# EasyEDA Pro project ProDoc_HEMY Brake Driver 1.1_2025-03-20.epro

# Schematic HEMY Brake Driver 1.1
Board Name: HEMY Brake Driver 1.1; Create Date: 2024-11-18; Page Name: Board; Project Name: TeenAstro Redux B; Schematic Name: HEMY Brake Driver 1.1; Update Date: 2024-12-15; Company: Club Astro Vélizy; Drawn: P. VINCENT; Page Size: A5; Part Number: HEMY_BRAKE_001; Reviewed: P. VINCENT; Version: V1.0
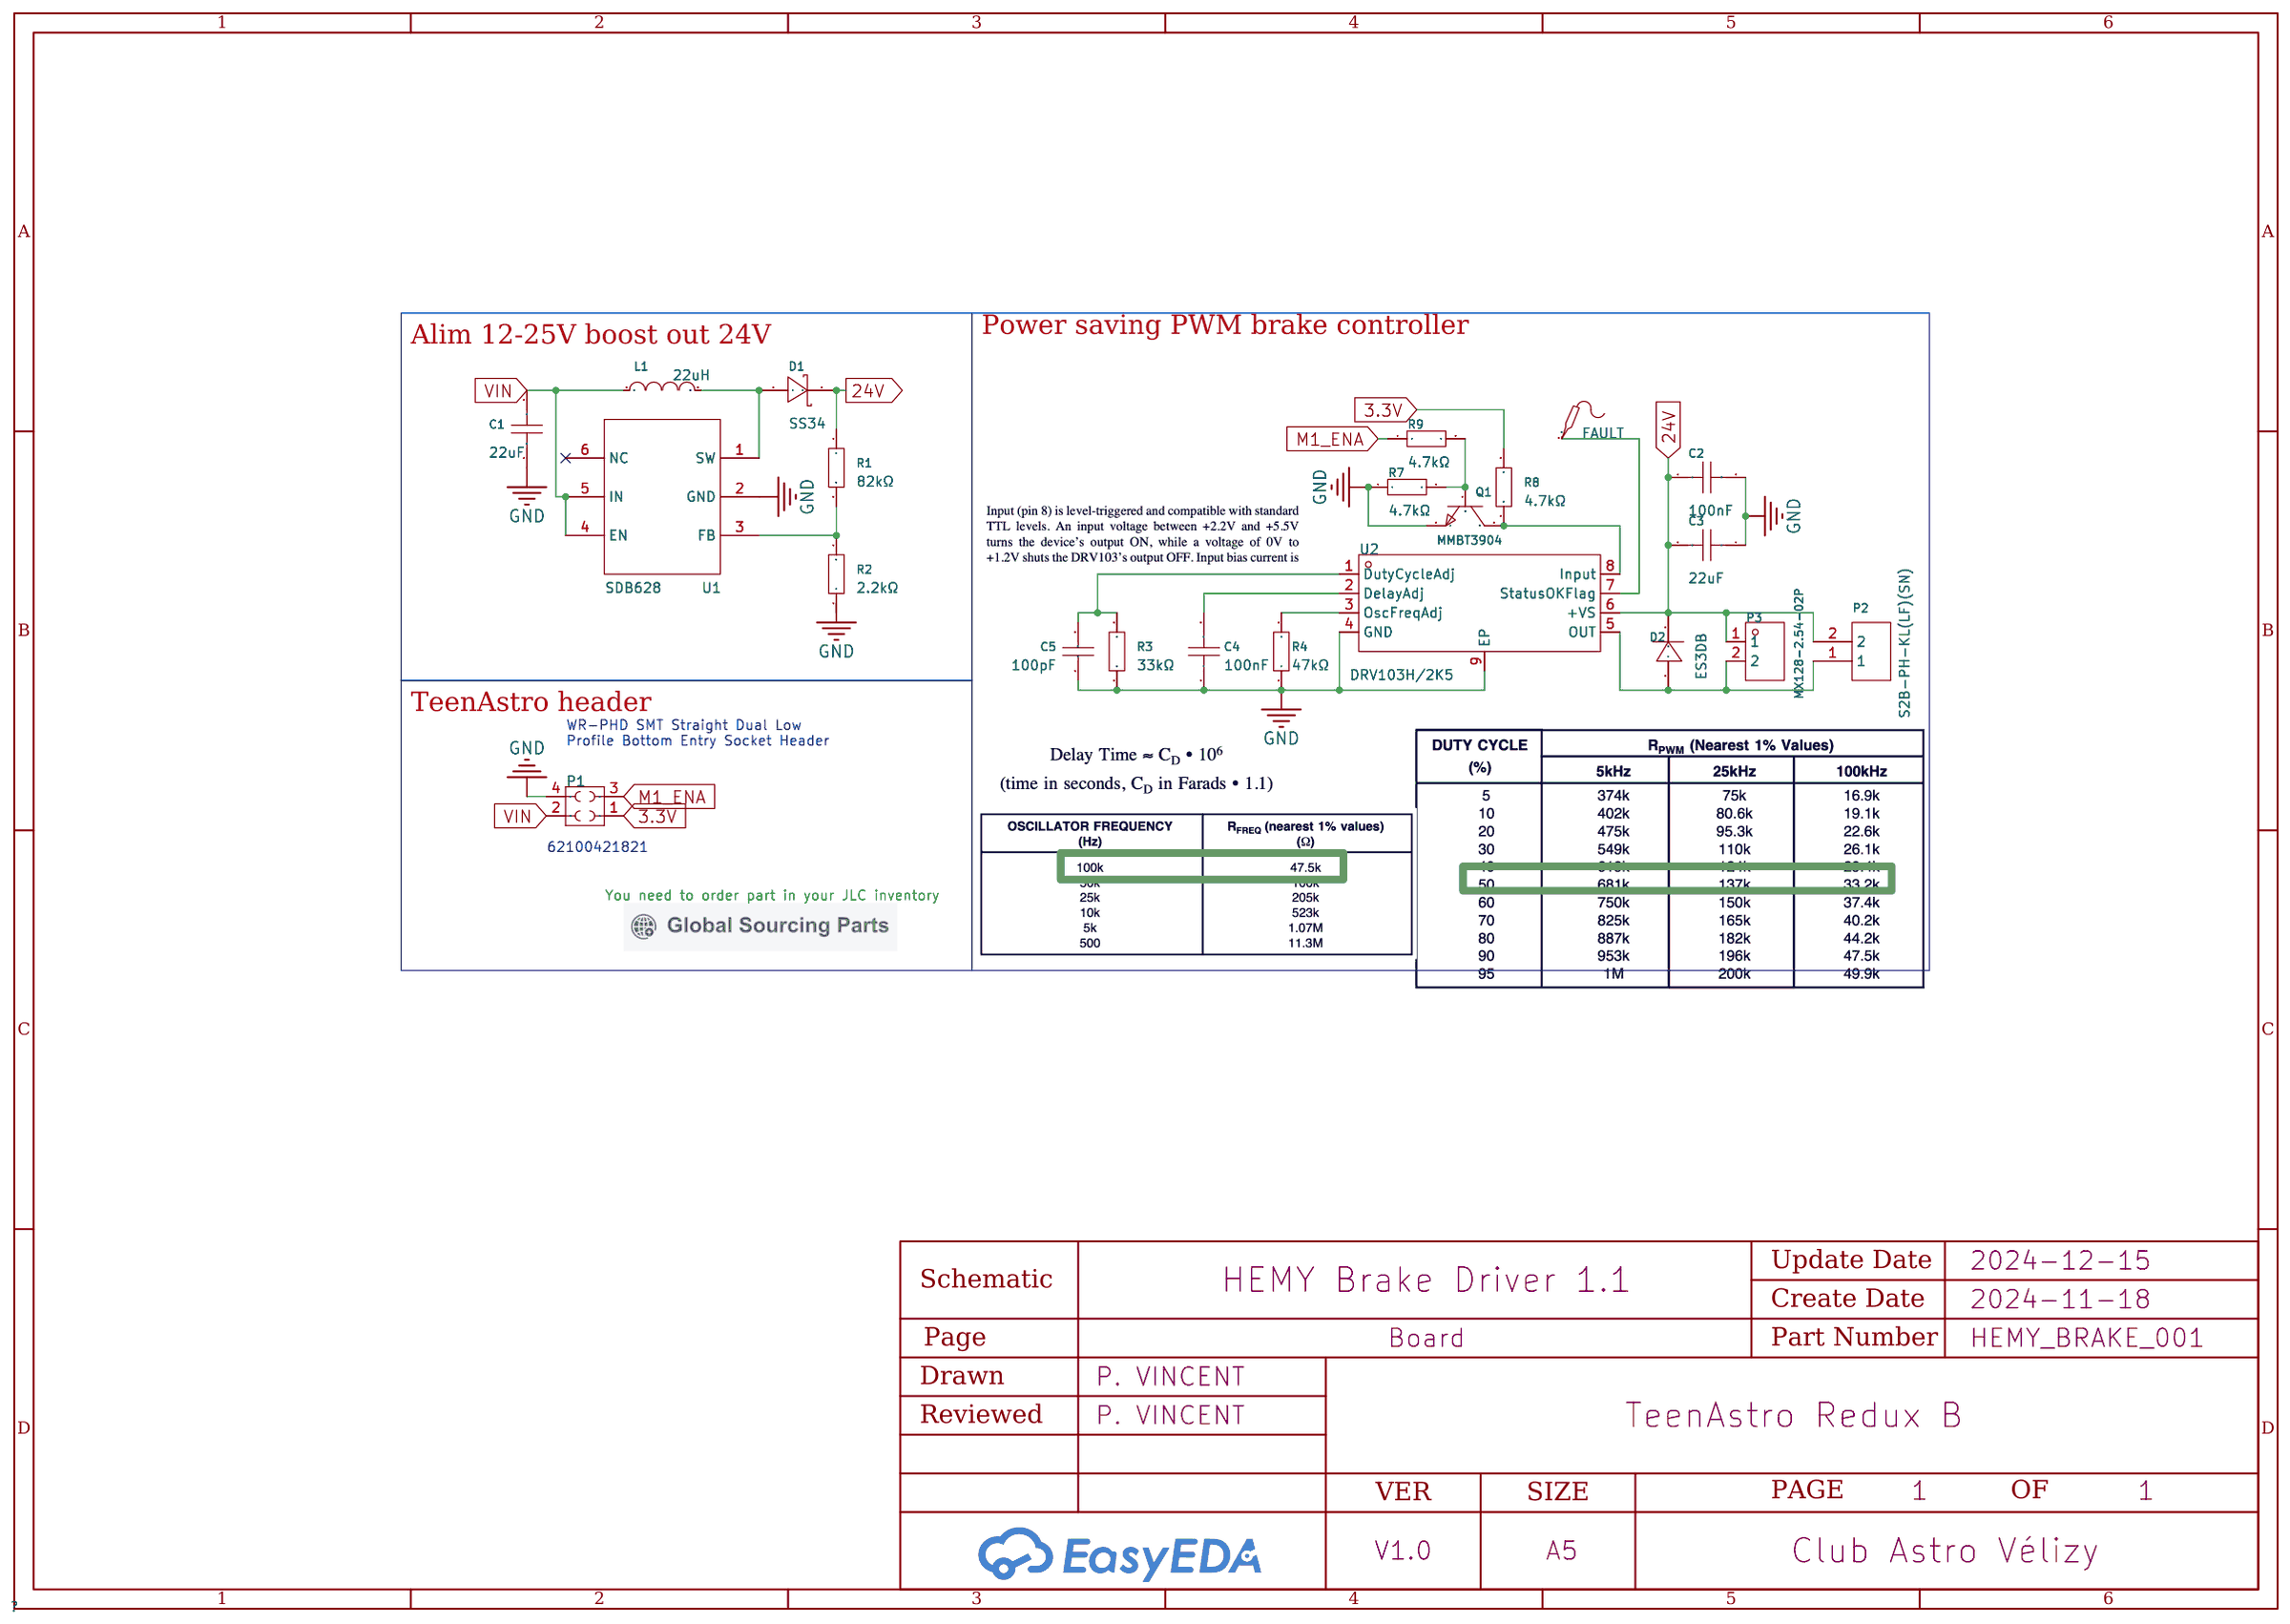
[diagram p0: schematic sheet]

## Parts
C1  22uF  [C0805]
C2  100nF  [C0805]
C3  22uF  [C0805]
C4  100nF  [C0603]
C5  100pF  [C0603]
D1  SS34  [SMA_L4.3-W2.6-LS5.2-RD]
D2  ES3DB  [SMB_L4.6-W3.6-LS5.3-RD]
FAULT  -  [Test-Point-0.5mm]
L1  22uH  [IND-SMD_L7.1-W6.6]
P1  -  [62100421821]
P2  S2B-PH-KL(LF)(SN)  [CONN-TH-2P-P2.00_S2B-PH-KL-LF-SN]  (no BOM)
P3  MX128-2.54-02P  [CONN-TH_2P-P2.54_MX128-2.54-GN01-02P-CU-Y-A]
Q1  MMBT3904  [SOT-23-3_L2.9-W1.3-P1.90-LS2.4-BR]
R1  82kΩ  [R0603]
R2  2.2kΩ  [R0603]
R3  33kΩ  [R0603]
R4  47kΩ  [R0603]
R7  4.7kΩ  [R0603]
R8  4.7kΩ  [R0603]
R9  4.7kΩ  [R0603]
U1  SDB628  [SOT-23-6_L2.9-W1.6-P0.95-LS2.8-BR]
U2  DRV103H/2K5  [SOIC-8_L4.9-W3.9-P1.27-LS6.0-BL-EP2.3]

## Library data of the parts
C1 C3 = CGA0805X5R226M350MT: Capacitance:22uF Tolerance:±20% Tolerance:±20% Voltage Rated: Temperature Coefficient:; LCSC Part Name: 22uF ±20% 35V; Supplier Part: C6119901; Manufacturer: HRE(芯声); Supplier Footprint: 0805; JLCPCB Part Class: Extended Part; Datasheet: https://atta.szlcsc.com/upload/public/pdf/source/20231129/D589D0CC4D260F7AC3A77E53B455CCB3.pdf; Supplier: LCSC; Tolerance: ±20%
C2 = CC0805KRX7R9BB104: Capacitance: Tolerance:±10% Tolerance:±10% Voltage Rated: Temperature Coefficient:; LCSC Part Name: 100nF ±10% 50V; Supplier Part: C49678; Manufacturer: YAGEO(国巨); Supplier Footprint: 0805; JLCPCB Part Class: Basic Part; Datasheet: https://atta.szlcsc.com/upload/public/pdf/source/20180224/C181747_15194369449651363981.pdf; Supplier: LCSC; Tolerance: ±10%
C4 = CC0603KRX7R9BB104: Capacitance: Tolerance:±10% Tolerance:±10% Voltage Rated: Temperature Coefficient:; LCSC Part Name: 100nF±10%50V; Supplier Part: C14663; Manufacturer: YAGEO(国巨); Supplier Footprint: 0603; JLCPCB Part Class: BasicPart; Datasheet: https://atta.szlcsc.com/upload/public/pdf/source/20180910/C282072_33301C7F631E79921B82A8DAC6BCC5B3.pdf; Supplier: LCSC; Tolerance: ±10%
C5 = CL10C101JB8NNNC: Capacitance: Tolerance:±5% Tolerance:±5% Voltage Rated: Temperature Coefficient:; LCSC Part Name: 100pF ±5% 50V; Supplier Part: C14858; Manufacturer: SAMSUNG(三星); Supplier Footprint: 0603; JLCPCB Part Class: Basic Part; Datasheet: https://atta.szlcsc.com/upload/public/pdf/source/20160103/1457707672333.pdf; Supplier: LCSC; Tolerance: ±5%
D1 = SS34_C8678: Diode Configuration:Single Forward Voltage (Vf@If):550mV@3A Reverse Voltage (Vr):40V Rectified Current:3A Reverse Leakage Current (Ir):500uA@40V; LCSC Part Name: 电压:40V 电流:3A; Supplier Part: C8678; Manufacturer: MDD(辰达半导体); Supplier Footprint: SMA(DO-214AC); JLCPCB Part Class: Basic Part; Datasheet: https://atta.szlcsc.com/upload/public/pdf/source/20230314/A80AE34493C69B89E2F4B1712F433538.pdf; Supplier: LCSC; Diode Configuration: Single; Forward Voltage (Vf@If): 550mV@3A; Reverse Voltage (Vr): 40V; Rectified Current: 3A; Reverse Leakage Current (Ir): 500uA@40V
D2 = ES3DB_C64975: Diode Configuration: Forward Voltage (Vf@If):1V@3A Reverse Voltage (Vr): Rectified Current: Reverse Leakage Current:5uA@200V Reverse Recovery Time (trr): Operating Temperature:-55℃~+150℃@(Tj) Operating Temperature:-55℃~+150℃@(Tj); LCSC Part Name: 电压:200V 电流:3A; Supplier Part: C64975; Manufacturer: MDD(辰达半导体); Supplier Footprint: DO-214AA(SMB); JLCPCB Part Class: Extended Part; Datasheet: https://atta.szlcsc.com/upload/public/pdf/source/20230314/57528205CBDE1D6077C2A8DCDEEC193A.pdf; Supplier: LCSC; Forward Voltage (Vf@If): 1V@3A; Reverse Leakage Current: 5uA@200V; Operating Temperature: -55℃~+150℃@(Tj)
FAULT = Test-Point: Test Point 测试点
L1 = YSPI0630A-220M: Inductance: Tolerance:±20% Tolerance:±20% Rated Current: DC Resistance (DCR):; LCSC Part Name: 22uH ±20%; Supplier Part: C497873; Manufacturer: YJYCOIN(益嘉源); Supplier Footprint: SMD,6.6x7.1mm; JLCPCB Part Class: Extended Part; Datasheet: https://atta.szlcsc.com/upload/public/pdf/source/20200317/C497869_D09F597887D5FB8B541C5C98B400E286.pdf; Supplier: LCSC; Tolerance: ±20%
P1 = 6210XX21821_62100421821_
P2 = S2B-PH-KL(LF)(SN): Pins Structure:1x2P Pitch:2mm Mounting Style:Right-Angle Reference Series:PH Number of Pins:2P Number of Rows:1 Number of PINs Per Row:2 Row Spacing:- Current Rating (Max):2A Contact Material:Copper Alloy Contact Plating:Tin Operating Temperature Range:-2; LCSC Part Name: 1x2P 间距:2mm 弯插 系列:PH; Supplier Part: C160237; Manufacturer: JST; Supplier Footprint: 弯插,P=2mm; JLCPCB Part Class: Extended Part; Datasheet: https://atta.szlcsc.com/upload/public/pdf/source/20181010/C265101_22107ACC4D8714694FDA2DD97145FA81.pdf; Supplier: LCSC; Pins Structure: 1x2P; Pitch: 2mm; Mounting Style: Right-Angle; Reference Series: PH; Number of Pins: 2P; Number of Rows: 1; Number of PINs Per Row: 2; Current Rating (Max): 2A; Contact Material: Copper Alloy; Contact Plating: Tin; Operating Temperature Range: -25℃~+85℃; Rated Voltage (Max): 100V; Plastic Material: PA66; Flame Retardant Rating: UL94V-0; Supplementary Features: 打K脚; Colour: Gray; Z-Height of the Board: 4.8mm; X-Length of Bottom Edge on Board (Spacing Line): 5.9mm; Y-Width of Bottom Edge on Board: 7.6mm
P3 = MX128-2.54-02P-GN01-Cu-Y-A: Structure:1x2P Pitch:2.54mm Color:Green Mounting Style:Straight Current Rating (Max):6A Voltage Rating (Max):150V Number of Pins:2P Number of Rows:1 Wire Gauge - AWG:18~24 Wire Gauge - AWG:18~24 Wire Gauge - mm2:1 Wire Gauge - mm2:1 Number of PINs Per Row; LCSC Part Name: 2.54mm 1x2P 排数:1 每排P数:2 直插; Supplier Part: C5188442; Manufacturer: MAX(迈旭); Supplier Footprint: 插件,P=2.54mm; JLCPCB Part Class: Extended Part; Datasheet: https://atta.szlcsc.com/upload/public/pdf/source/20230914/7C75AD31AD41EB9EF855A76DB002C0D2.pdf; Supplier: LCSC; Structure: 1x2P; Pitch: 2.54mm; Color: Green; Mounting Style: Straight; Current Rating (Max): 6A; Voltage Rating (Max): 150V; Number of Pins: 2P; Number of Rows: 1; Wire Gauge - AWG: 18~24; Wire Gauge - mm2: 1; Number of PINs Per Row: 2; Contact Material: Copper Alloy; Contact Plating: Tin; Operating Temperature Range: -40℃~+105℃
Q1 = MMBT3904_C20526: Transistor Type: Collector Current (Ic): Collector-Emitter Breakdown Voltage (Vceo): Power Dissipation (Pd): DC Current Gain (hFE@Ic,Vce):100@10mA,1V DC Current Gain (hFE@Ic,Vce):100@10mA,1V Transition Frequency (fT):300MHz Collector Cut-Off Current (Icbo; LCSC Part Name: NPN 电流:200mA 耐压:40V hfe=100~300; Supplier Part: C20526; Manufacturer: CJ(江苏长电/长晶); Supplier Footprint: SOT-23; JLCPCB Part Class: Basic Part; Datasheet: https://atta.szlcsc.com/upload/public/pdf/source/20220704/70F575FB75061E03F919270A6BB8BA7F.pdf; Supplier: LCSC; DC Current Gain (hFE@Ic,Vce): 100@10mA,1V; Transition Frequency (fT): 300MHz; Collector Cut-Off Current (Icbo): 100nA; Collector-Emitter Saturation Voltage (VCE(sat)@Ic,Ib): 300mV@50mA,5mA
R1 = 0603WAF8202T5E: Type:Thick Film Resistors Resistance:82kΩ Tolerance:±1% Tolerance:±1% Power(Watts): Overload Voltage (Max): Temperature Coefficient:±100ppm/℃ Temperature Coefficient:±100ppm/℃ Operating Temperature Range:-55℃~+155℃ Operating Temperature Range:-55℃~+155℃; LCSC Part Name: 82kΩ ±1% 100mW 厚膜电阻; Supplier Part: C23254; Manufacturer: UNI-ROYAL(厚声); Supplier Footprint: 0603; JLCPCB Part Class: Basic Part; Datasheet: https://atta.szlcsc.com/upload/public/pdf/source/20200306/C422600_1E6D84923E4A46A82E41ADD87F860B5C.pdf; Supplier: LCSC; Type: Thick Film Resistors; Tolerance: ±1%; Temperature Coefficient: ±100ppm/℃; Operating Temperature Range: -55℃~+155℃
R2 = 0603WAF2201T5E_C4190: Type:Thick Film Resistors Resistance:2.2kΩ Tolerance:±1% Tolerance:±1% Power(Watts): Overload Voltage (Max): Temperature Coefficient:±100ppm/℃ Temperature Coefficient:±100ppm/℃ Operating Temperature Range:-55℃~+155℃ Operating Temperature Range:-55℃~+155℃; LCSC Part Name: 2.2kΩ ±1% 100mW 厚膜电阻; Supplier Part: C4190; Manufacturer: UNI-ROYAL(厚声); Manufacturer Part: 0603WAF2201T5E; Supplier Footprint: 0603; JLCPCB Part Class: Basic Part; Datasheet: https://atta.szlcsc.com/upload/public/pdf/source/20200306/C422600_1E6D84923E4A46A82E41ADD87F860B5C.pdf; Supplier: LCSC; Type: Thick Film Resistors; Tolerance: ±1%; Temperature Coefficient: ±100ppm/℃; Operating Temperature Range: -55℃~+155℃
R3 = 0603WAF3302T5E: Type:Thick Film Resistors Resistance:33kΩ Tolerance:±1% Tolerance:±1% Power(Watts): Overload Voltage (Max): Temperature Coefficient:±100ppm/℃ Temperature Coefficient:±100ppm/℃ Operating Temperature Range:-55℃~+155℃ Operating Temperature Range:-55℃~+155℃; LCSC Part Name: 33kΩ ±1% 100mW 厚膜电阻; Supplier Part: C4216; Manufacturer: UNI-ROYAL(厚声); Supplier Footprint: 0603; JLCPCB Part Class: Basic Part; Datasheet: https://atta.szlcsc.com/upload/public/pdf/source/20200306/C422600_1E6D84923E4A46A82E41ADD87F860B5C.pdf; Supplier: LCSC; Type: Thick Film Resistors; Tolerance: ±1%; Temperature Coefficient: ±100ppm/℃; Operating Temperature Range: -55℃~+155℃
R4 = 0603WAF4702T5E: Type:Thick Film Resistors Resistance:47kΩ Tolerance:±1% Tolerance:±1% Power(Watts): Overload Voltage (Max): Temperature Coefficient:±100ppm/℃ Temperature Coefficient:±100ppm/℃ Operating Temperature Range:-55℃~+155℃ Operating Temperature Range:-55℃~+155℃; LCSC Part Name: 47kΩ ±1% 100mW 厚膜电阻; Supplier Part: C25819; Manufacturer: UNI-ROYAL(厚声); Supplier Footprint: 0603; JLCPCB Part Class: Basic Part; Datasheet: https://atta.szlcsc.com/upload/public/pdf/source/20200306/C422600_1E6D84923E4A46A82E41ADD87F860B5C.pdf; Supplier: LCSC; Type: Thick Film Resistors; Tolerance: ±1%; Temperature Coefficient: ±100ppm/℃; Operating Temperature Range: -55℃~+155℃
R7-R9 = 0603WAF4701T5E: Type:Thick Film Resistors Resistance:4.7kΩ Tolerance:±1% Tolerance:±1% Power(Watts): Overload Voltage (Max): Temperature Coefficient:±100ppm/℃ Temperature Coefficient:±100ppm/℃ Operating Temperature Range:-55℃~+155℃ Operating Temperature Range:-55℃~+155℃; LCSC Part Name: 4.7kΩ ±1% 100mW 厚膜电阻; Supplier Part: C23162; Manufacturer: UNI-ROYAL(厚声); Supplier Footprint: 0603; JLCPCB Part Class: Basic Part; Datasheet: https://atta.szlcsc.com/upload/public/pdf/source/20200306/C422600_1E6D84923E4A46A82E41ADD87F860B5C.pdf; Supplier: LCSC; Type: Thick Film Resistors; Tolerance: ±1%; Temperature Coefficient: ±100ppm/℃; Operating Temperature Range: -55℃~+155℃
U1 = SDB628: Function:boost converterType Input Voltage:2V~24V Input Voltage:2V~24V Output Voltage:28V Output Voltage:28V Output Current (Max):2A Switching Frequency:1.2MHz Synchronous Rectification:NO Number of Outputs:1 Topology:Boost Switch tube (built-in/external); Supplier Part: C77805; Manufacturer: SHOUDING(首鼎半导体); Supplier Footprint: SOT-23-6; JLCPCB Part Class: Extended Part; Datasheet: https://atta.szlcsc.com/upload/public/pdf/source/20160823/1471947522087.pdf; Supplier: LCSC; Function: boost converterType; Input Voltage: 2V~24V; Output Voltage: 28V; Output Current (Max): 2A; Switching Frequency: 1.2MHz; Synchronous Rectification: NO; Number of Outputs: 1; Topology: Boost; Switch tube (built-in/external): 内置
U2 = DRV103H/2K5: Supplier Part: C544418; Manufacturer: TI(德州仪器); Supplier Footprint: SOIC-8-EP; JLCPCB Part Class: Extended Part; Datasheet: https://www.ti.com/cn/lit/gpn/drv103; Supplier: LCSC

## Nets
3.3V: P1.1 R8.2
24V: C2.1 C3.2 D1.1(K) D2.1(C) P2.2 P3.1 R1.1 U2.6(+VS)
GND: C1.1 C2.2 C3.1 C4.1 C5.1 P1.4 Q1.2(E) R2.1 R3.1 R4.1 R7.1 U1.2(GND) U2.4(GND) U2.9(EP)
VIN: C1.2 L1.1 P1.2 U1.4(EN) U1.5(IN)
M1_ENA: P1.3 R9.1
$1N4023: R4.2 U2.3(OscFreqAdj)
$1N4066: C5.2 R3.2 U2.1(DutyCycleAdj)
$1N4441: Q1.3(C) R8.1 U2.8(Input)
$1N5858: D1.2(A) L1.2 U1.1(SW)
$1N9857: R1.2 R2.2 U1.3(FB)
$1N10088: C4.2 U2.2(DelayAdj)
$1N16383: FAULT.1 U2.7(StatusOKFlag)
$1N19329: Q1.1(B) R7.2 R9.2
Net-(D2-2): D2.2(A) P2.1 P3.2 U2.5(OUT)

Not connected (* = marked no-connect by the designer): U1 6(NC)*

## Notes on the sheet
- Power saving PWM brake controller
- Alim 12-25V boost out 24V
- TeenAstro header
- WR-PHD SMT Straight Dual Low
  Profile Bottom Entry Socket Header
- 62100421821
- You need to order part in your JLC inventory

# Board HEMY Brake Driver 1.1
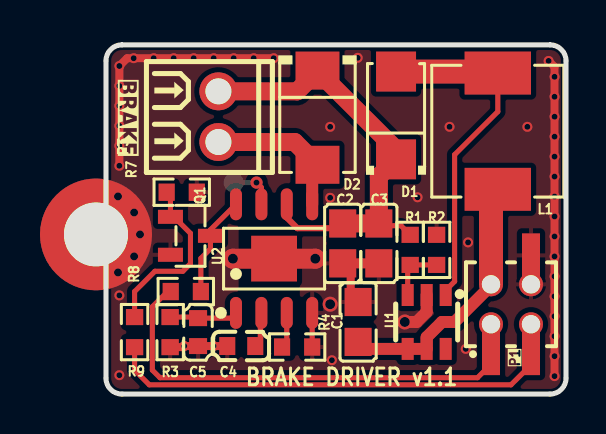
[diagram p1: board, top side]
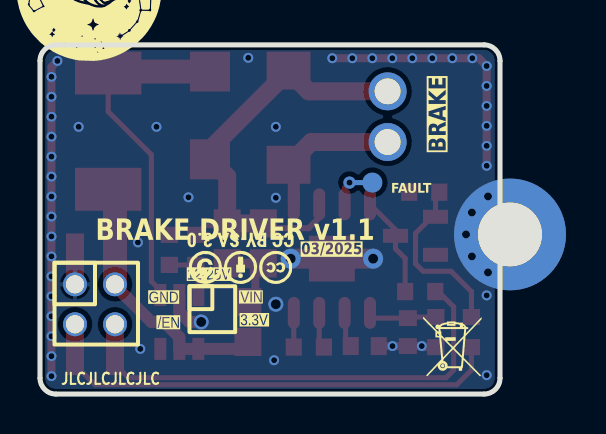
[diagram p2: board, bottom side, seen from below]

Outline 23 x 17.5 mm; copper layers: Top Layer, Bottom Layer. Coordinates in mm from the lower left corner of the outline.
Outline path: 0,16.7 0,0.8 arc(0.23,0.23) 0.8,0 22.2,0 arc(22.77,0.23) 23,0.8 23,16.7 arc(22.77,17.27) 22.2,17.5 0.8,17.5 arc(0.23,17.27) 0,16.7
Stack: Top Layer 0.035mm / Dielectric1 0.71mm FR4 er 4.5 / Bottom Layer 0.035mm

## Design rules (mm)
template: Custom Config
spacing copperThickness1oz (default): track to track 0.102, other pairs 0.15 to 0.3
spacing copperThickness2oz: track to track 0.203, other pairs 0.152 to 0.3
track width copperThickness1oz (default): min 0.127, default 0.254, max 2.54
track width copperThickness2oz: min 0.203, default 0.254, max 2.54
differential pair differentialPair (default): width min 0.127, default 0.254, max 2.54; gap min 0.152, default 0.152
via viaSize (default): diameter min 0.5, default 0.61, max 10; hole min 0.25, default 0.305, max 6.3

## Placement (name value [footprint] x y rotation side)
C1  22uF  [C0805]  12.6 3.61 270 top
C2  100nF  [C0805]  11.84 7.55 270 top
C3  22uF  [C0805]  13.64 7.55 90 top
C4  100nF  [C0603]  6.76 2.41 0 top
C5  100pF  [C0603]  4.6 3.11 90 top
D1  SS34  [SMA_L4.3-W2.6-LS5.2-RD]  14.5 13.96 90 top
D2  ES3DB  [SMB_L4.6-W3.6-LS5.3-RD]  10.57 13.85 270 top
FAULT  -  [Test-Point-0.5mm]  6.38 10.6 180 bottom
L1  22uH  [IND-SMD_L7.1-W6.6]  19.59 13.17 90 top
NOREF  -  [Pad_e8820]  -0.5 8 0 top
P1  -  [62100421821]  20.25 4.5 0 top
P3  MX128-2.54-02P  [CONN-TH_2P-P2.54_MX128-2.54-GN01-02P-CU-Y-A]  5.62 13.9 270 top
Q1  MMBT3904  [SOT-23-3_L2.9-W1.3-P1.90-LS2.4-BR]  4.22 7.93 180 top
R1  82kΩ  [R0603]  15.21 7.23 270 top
R2  2.2kΩ  [R0603]  16.53 7.23 270 top
R3  33kΩ  [R0603]  3.21 3.11 90 top
R4  47kΩ  [R0603]  9.56 2.36 180 top
R7  4.7kΩ  [R0603]  3.79 10.12 180 top
R8  4.7kΩ  [R0603]  3.99 5.14 180 top
R9  4.7kΩ  [R0603]  1.43 3.11 90 top
U1  SDB628  [SOT-23-6_L2.9-W1.6-P0.95-LS2.8-BR]  16.03 3.61 90 top
U2  DRV103H/2K5  [SOIC-8_L4.9-W3.9-P1.27-LS6.0-BL-EP2.3]  8.4 6.79 0 top

## Footprints (pads in the part's own frame, mm; a bottom-side part is the same pattern mirrored in y, then rotated)
62100421821
  round 1.2 hole 0.914x0.85: 1(-1,-1) 2(-1,1) 3(1,-1) 4(1,1)
  rect 0.9x2.2 smd: 1(-1,-2.45) 2(-1,2.45) 3(1,-2.45) 4(1,2.45)
C0603
  rect 0.8x0.9 smd: 1(-0.7,0) 2(0.7,0)
C0805
  rect 1.41x1.35 smd: 1(-1,0) 2(1,0)
CONN-TH_2P-P2.54_MX128-2.54-GN01-02P-CU-Y-A
  round 1.9 hole 1.3: 1(-1.27,0) 2(1.27,0)
IND-SMD_L7.1-W6.6
  rect 2.15x3.32 smd: 1(-2.913,0) 2(2.913,0)
Pad_e8820
  round 5.6 hole 3.2: 1(0,0)
R0603
  rect 0.806x0.864 smd: 1(-0.753,0) 2(0.753,0)
SMA_L4.3-W2.6-LS5.2-RD
  rect 2x2 smd: 1(-2.2,0) 2(2.2,0)
SMB_L4.6-W3.6-LS5.3-RD
  rect 1.9x2.192 smd: 1(-2.361,0) 2(2.361,0)
SOIC-8_L4.9-W3.9-P1.27-LS6.0-BL-EP2.3
  oval 0.6x1.6 smd: 1(-1.905,-2.72) 2(-0.635,-2.72) 3(0.635,-2.72) 4(1.905,-2.72) 5(1.905,2.72) 6(0.635,2.72) 7(-0.635,2.72) 8(-1.905,2.72)
  rect 2.29x2.29 smd: 9(0,0)
SOT-23-3_L2.9-W1.3-P1.90-LS2.4-BR
  rect 1.25x0.7 smd: 1(1,-0.95) 2(1,0.95) 3(-1,0)
SOT-23-6_L2.9-W1.6-P0.95-LS2.8-BR
  rect 1.1x0.6 smd: 1(1.35,-0.95) 2(1.35,0) 3(1.35,0.95) 4(-1.35,0.95) 5(-1.35,0) 6(-1.35,-0.95)
Test-Point-0.5mm
  round 1 smd: 1(0,0)

## Nets
As in the schematic, except:
GND: C1.1 C2.2 C3.1 C4.1 C5.1 NOREF.1 P1.4 Q1.2 R2.1 R3.1 R4.1 R7.1 U1.2 U2.4 U2.9
$1N4182: D2.2 P3.2 U2.5

Pads without a net: U1 6

## Via types
v1: diameter 0.5, hole 0.4, Top Layer to Bottom Layer, 5 vias
v2: diameter 0.5, hole 0.3, Top Layer to Bottom Layer, 44 vias
v3: diameter 0.75, hole 0.5, Top Layer to Bottom Layer, 2 vias
v4: diameter 1, hole 0.5, Top Layer to Bottom Layer, 2 vias
v5: diameter 0.61, hole 0.305, Top Layer to Bottom Layer, 1 via

## Routing (per net, layer and track width the routed paths; a pad name or vN(x,y) marks a point on that pad's centre or on a via; arc(x,y) is an arc through that point)
3.3V: length 22.3
  Top Layer w0.254: P1.1 19.25,1.5 18.57,0.82 2.7,0.82 2.32,1.2 2.32,4.38 3.08,5.14 R8.2
24V: length 22.4
  Top Layer w0.254: C3.2 13.75,8.44 14.75,8.44 R1.1
  Top Layer w0.3: C2.1 11.6,8.31 9.57,8.31 9.04,8.84 U2.6
  Top Layer w0.9: C2.1 C3.2 13.64,10.9 14.5,11.76 14.5,12.26 10.57,16.19 ; 10.57,16.19 9.56,15.17 5.62,15.17 ; 10.57,16.19 D2.1
GND: length 43.9
  Top Layer w0.254: 10.31,2.36 U2.4
  Top Layer w0.4: v2(22.13,16.69) 22.43,16.4 v2(22.43,15.9) v2(22.43,14.9) v2(22.43,13.9) v2(22.43,12.9) v2(22.43,11.9) v2(22.43,10.9) v2(22.43,9.9) v2(22.43,8.9) v2(22.43,7.9) v2(22.43,6.9) v2(22.43,5.9) v2(22.43,4.9) v2(22.43,3.9) v2(22.43,2.9) v2(22.43,1.9) v2(22.43,0.9) ; v2(0.67,11.44) v2(0.67,12.44) v2(0.67,13.44) v2(0.67,14.44) v2(0.67,15.44) v2(0.67,16.44) 1.06,16.83 v2(1.38,16.83) v2(2.38,16.83) v2(3.38,16.83) v2(4.38,16.83) v2(5.38,16.83) v2(6.38,16.83) v2(7.38,16.83) v2(8.38,16.83) ; C5.1 6.06,2.41 ; C1.1 12.49,4.73 12.24,4.73 12.24,6.15 C2.2 ; R3.1 3.86,2.35 v2(3.91,2.41) 4.6,2.41
  Top Layer w0.5: C2.2 C3.1
  Top Layer w0.6: U1.2 16.03,4.12 15.53,3.61 v3(14.94,3.61)
  Top Layer w1: v4(6.34,6.78) v4(10.46,6.78)
  vias: v1(0.6,9.91) v1(0.6,6.09) v1(1.41,9.1) v1(1.41,6.9) v1(1.7,8) v2(0.67,4.95) v2(0.67,0.95) v2(5.38,2.41) v2(11.21,13.39) v2(11.21,9.84) v2(11.29,1.7) v2(12.59,16.85) v2(15.58,9.86) v2(17.18,13.39) v2(17.99,2.26) v2(18.1,7.6) v2(21.07,13.39) v3(11.21,4.5)
VIN: length 13.1
  Top Layer w0.6: 19.25,5.43 17.43,3.61 16.8,3.61 16.03,2.85 U1.5 U1.4 12.96,2.26 C1.2
  Top Layer w1.2: 19.25,5.7 P1.2 19.25,9.92 L1.1
M1_ENA: length 22.3
  Top Layer w0.254: R9.1 1.43,1.2 2.17,0.46 20.25,0.46 21.25,1.46 P1.3
$1N4023: length 1.8
  Top Layer w0.254: R4.2 9.04,2.59 U2.3
$1N4066: length 3.4
  Top Layer w0.254: U2.1 6.24,3.81 C5.2 4.55,3.86 R3.2
$1N4182: length 7.5
  Top Layer w0.6: U2.5 10.31,11.23 D2.2
  Top Layer w0.9: P3.2 9.43,12.63 D2.2
$1N4441: length 5.1
  Top Layer w0.254: U2.8 5.22,8.23 Q1.3 5.22,7.28 4.74,6.8 R8.1
$1N5858: length 17.3
  Top Layer w0.254: U1.1 16.98,5.2 17.43,5.65 17.43,12 19.59,14.16 L1.2
  Top Layer w1.2: L1.2 19.51,16.16 14.5,16.16
$1N9857: length 2.9
  Top Layer w0.254: R2.2 R1.2 15.08,6.35 U1.3
$1N10088: length 1.8
  Top Layer w0.254: U2.2 7.72,4.02 7.72,2.66 C4.2
$1N16383: length 2.3
  Top Layer w0.254: U2.7 7.77,10.36 v5(7.53,10.6)
  Bottom Layer w0.254: v5(7.53,10.6) FAULT.1
$1N19329: length 8.8
  Top Layer w0.254: R9.2 1.43,5.14 2.44,6.15 3.84,6.15 4.22,6.53 4.22,8.06 3.4,8.88 Q1.1 3.22,9.93 3.03,10.12

## Copper pours and planes (outline as drawn; the poured copper is in the pictures)
GND on Top Layer: -0.98,17.84 24.67,17.84 24.67,-0.2 -0.98,-0.2
GND on Bottom Layer: -0.98,17.84 24.67,17.84 24.67,-0.2 -0.98,-0.2

## Text on the board
Bottom Silkscreen Layer: JLCJLCJLCJLC | 03/2025 | BRAKE | BRAKE DRIVER v1.1 | VIN | 12-25V | GND | 3.3V | /EN
Document Layer: Order this part in your JLC inventory: / WR-PHD SMT 62100421821
Top Silkscreen Layer: BRAKE DRIVER v1.1 | BRAKE
